# EAGLE design clock (EAGLE 9.6.2)
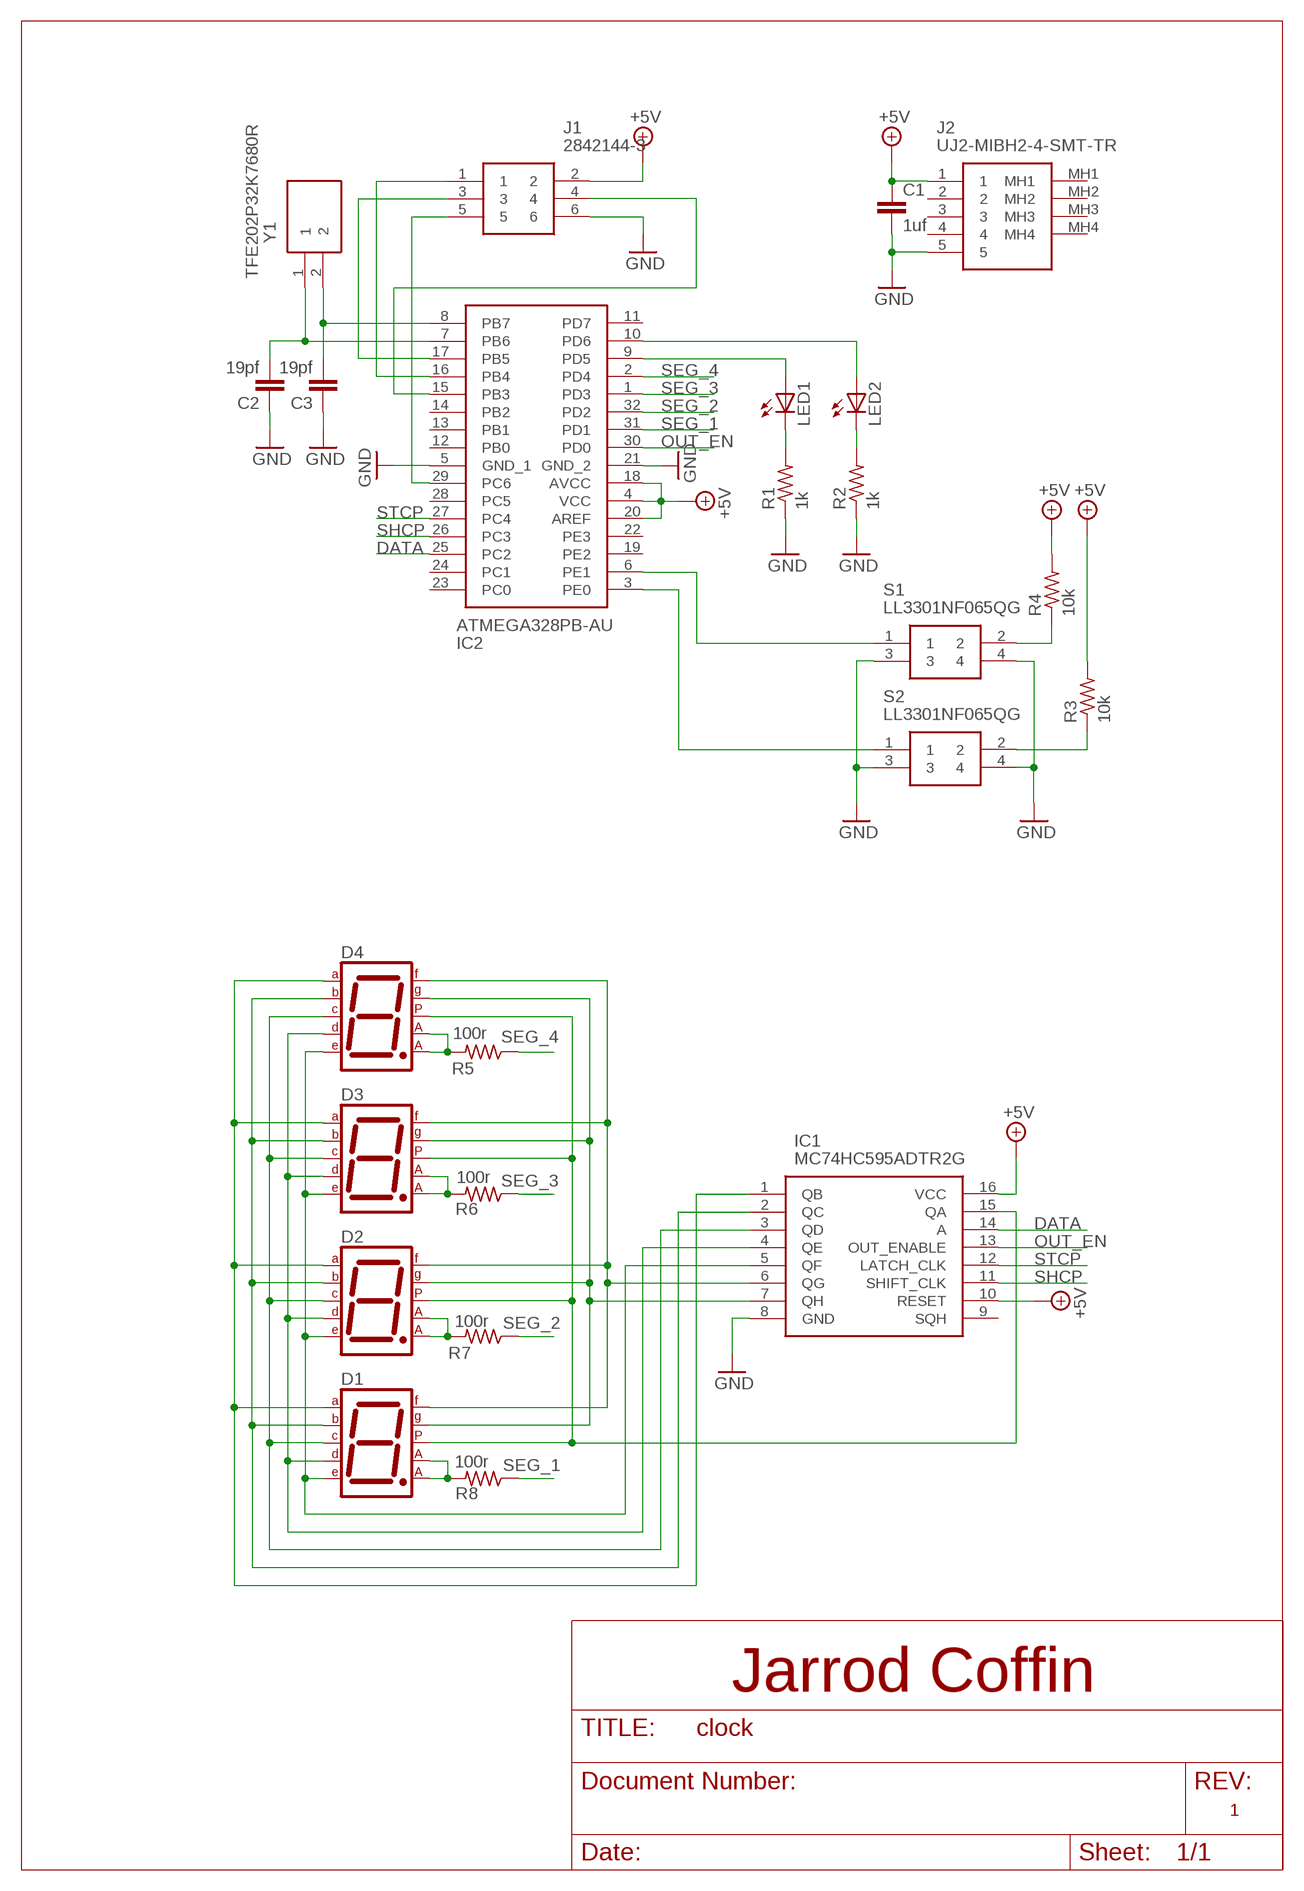
[diagram p0: schematic, sheet 1]

## Parts
C1  1uf  C-EUC0805  [C0805]
C2  19pf  C-EUC0603  [C0603]
C3  19pf  C-EUC0603  [C0603]
D1  7SEG-CA  [7SEG-13]
D2  7SEG-CA  [7SEG-13]
D3  7SEG-CA  [7SEG-13]
D4  7SEG-CA  [7SEG-13]
IC1  MC74HC595ADTR2G  [SOP65P640X120-16N]
IC2  ATMEGA328PB-AU  [QFP80P900X900X120-32N]
J1  2842144-3  [HUSSP6W50P200_2X3_600X400X590P]
J2  UJ2-MIBH2-4-SMT-TR  [UJ2MIBH24SMTTR]
LED1  LED3MM  [LED3MM]
LED2  LED3MM  [LED3MM]
R1  1k  R-US_R0805  [R0805]
R2  1k  R-US_R0805  [R0805]
R3  10k  R-US_R0805  [R0805]
R4  10k  R-US_R0805  [R0805]
R5  100r  R-US_R0805  [R0805]
R6  100r  R-US_R0805  [R0805]
R7  100r  R-US_R0805  [R0805]
R8  100r  R-US_R0805  [R0805]
S1  LL3301NF065QG  [LL3301NF065QG]
S2  LL3301NF065QG  [LL3301NF065QG]
Y1  TFE202P32K7680R  [TFE202P32K7680R]

## Nets
+5V: C1.1 IC1.10(RESET) IC1.16(VCC) IC2.4(VCC) IC2.18(AVCC) IC2.20(AREF) J1.2 J2.1 R3.2 R4.2
DATA: IC1.14(A) IC2.25(PC2)
GND: C1.2 C2.1 C3.1 IC1.8(GND) IC2.5(GND_1) IC2.21(GND_2) J1.6 J2.5 R1.1 R2.1 S1.3 S1.4 S2.3 S2.4
N$1: D1.10(G) D2.10(G) D3.10(G) D4.10(G) IC1.7(QH)
N$2: D1.9(F) D2.9(F) D3.9(F) D4.9(F) IC1.6(QG)
N$3: LED1.K(C) R1.2
N$4: LED2.K(C) R2.2
N$5: IC2.9(PD5) LED1.A
N$6: IC2.10(PD6) LED2.A
N$7: D1.5(DP) D2.5(DP) D3.5(DP) D4.5(DP) IC1.15(QA)
N$8: D1.1(E) D2.1(E) D3.1(E) D4.1(E) IC1.5(QF)
N$9: D1.2(D) D2.2(D) D3.2(D) D4.2(D) IC1.4(QE)
N$10: D1.4(C) D2.4(C) D3.4(C) D4.4(C) IC1.3(QD)
N$11: D1.6(B) D2.6(B) D3.6(B) D4.6(B) IC1.2(QC)
N$12: D1.7(A) D2.7(A) D3.7(A) D4.7(A) IC1.1(QB)
N$13: IC2.29(PC6) J1.5
N$14: IC2.15(PB3) J1.4
N$15: IC2.16(PB4) J1.1
N$16: IC2.17(PB5) J1.3
N$17: R4.1 S1.2
N$18: R3.1 S2.2
N$19: C2.2 IC2.7(PB6) Y1.1
N$20: IC2.3(PE0) S2.1
N$21: IC2.6(PE1) S1.1
N$23: D1.3(CA1) D1.8(CA2) R8.2
N$24: C3.2 IC2.8(PB7) Y1.2
N$26: D2.3(CA1) D2.8(CA2) R7.2
N$27: D3.3(CA1) D3.8(CA2) R6.2
N$29: D4.3(CA1) D4.8(CA2) R5.2
OUT_EN: IC1.13(OUT_ENABLE) IC2.30(PD0)
SEG_1: IC2.31(PD1) R8.1
SEG_2: IC2.32(PD2) R7.1
SEG_3: IC2.1(PD3) R6.1
SEG_4: IC2.2(PD4) R5.1
SHCP: IC1.11(SHIFT_CLK) IC2.26(PC3)
STCP: IC1.12(LATCH_CLK) IC2.27(PC4)
Unconnected: IC1.9(SQH) IC2.11(PD7) IC2.12(PB0) IC2.13(PB1) IC2.14(PB2) IC2.19(PE2) IC2.22(PE3) IC2.23(PC0) IC2.24(PC1) IC2.28(PC5) J2.2 J2.3 J2.4 J2.MH1 J2.MH2 J2.MH3 J2.MH4

## Notes on the sheet
- Jarrod Coffin
- 1

## Library data of the parts
C1-C3 = rcl:C-EU: CAPACITOR, European symbol; SPICEPREFIX: C
D1-D4 = special:7SEG-CA: 7-segment DISPLAY single anode, 13 mm
IC1 = SamacSys_Parts:MC74HC595ADTR2G: 8-Bit Shift Register SER-SER/PAR TSSOP16 MC74HC595ADTR2G, 8-stage Shift Register, Serial to Serial/Parallel, 2 6 V, 16-Pin TSSOP-16 Source: Datasheet <https://componentsearchengine.com/Datasheets/1/MC74HC595ADTR2G.pdf>; DESCRIPTION: 8-Bit Shift Register SER-SER/PAR TSSOP16 MC74HC595ADTR2G, 8-stage Shift Register, Serial to Serial/Parallel, 2 6 V, 16-Pin TSSOP-16; HEIGHT: 1.2mm; MANUFACTURER_NAME: ON Semiconductor; MANUFACTURER_PART_NUMBER: MC74HC595ADTR2G; MOUSER_PART_NUMBER: 863-MC74HC595ADTR2G; MOUSER_PRICE-STOCK: https://www.mouser.com/Search/Refine.aspx?Keyword=863-MC74HC595ADTR2G
IC2 = SamacSys_Parts:ATMEGA328PB-AU: ATMEL - ATMEGA328PB-AU - MCU, 8BIT, ATMEGA, 20MHZ, TQFP-32 Source: Datasheet <http://www.farnell.com/datasheets/2014286.pdf>; ARROW_PART_NUMBER: ATMEGA328PB-AU; ARROW_PRICE-STOCK: https://www.arrow.com/en/products/atmega328pb-au/microchip-technology; DESCRIPTION: ATMEL - ATMEGA328PB-AU - MCU, 8BIT, ATMEGA, 20MHZ, TQFP-32; HEIGHT: 1.2mm; MANUFACTURER_NAME: Microchip; MANUFACTURER_PART_NUMBER: ATMEGA328PB-AU; MOUSER_PART_NUMBER: 556-ATMEGA328PB-AU; MOUSER_PRICE-STOCK: https://www.mouser.co.uk/ProductDetail/Microchip-Technology-Atmel/ATMEGA328PB-AU?qs=jy4bLUHv09hbFONgGrqPbw%3D%3D
J1 = SamacSys_Parts:2842144-3: Board to Board & Mezzanine Connectors 6P,2MM,BRK HDR,DRVT, SMD,0.76AU,TR W/CAP Source: Datasheet <https://componentsearchengine.com/Datasheets/2/2842144-3.pdf>; ARROW_PART_NUMBER: 2842144-3; DESCRIPTION: Board to Board & Mezzanine Connectors 6P,2MM,BRK HDR,DRVT, SMD,0.76AU,TR W/CAP; HEIGHT: mm; MANUFACTURER_NAME: TE Connectivity; MANUFACTURER_PART_NUMBER: 2842144-3; MOUSER_PART_NUMBER: 571-2842144-3; MOUSER_PRICE-STOCK: https://www.mouser.co.uk/ProductDetail/TE-Connectivity/2842144-3?qs=Cb2nCFKsA8oUVnOWAoq9Vg%3D%3D
J2 = SamacSys_Parts:UJ2-MIBH2-4-SMT-TR: CONN RCPT USB2.0 MICRO B SMD R/A Source: Datasheet <https://www.cui.com/product/resource/digikeypdf/uj2-mibh2-4-smt.pdf>; ARROW_PART_NUMBER: UJ2-MIBH2-4-SMT-TR; ARROW_PRICE-STOCK: https://www.arrow.com/en/products/uj2-mibh2-4-smt-tr/cui-devices; DESCRIPTION: CONN RCPT USB2.0 MICRO B SMD R/A; HEIGHT: 2.5mm; MANUFACTURER_NAME: CUI Devices; MANUFACTURER_PART_NUMBER: UJ2-MIBH2-4-SMT-TR; MOUSER_PART_NUMBER: 490-UJ2-MIBH2-4-SMT; MOUSER_PRICE-STOCK: https://www.mouser.co.uk/ProductDetail/CUI-Devices/UJ2-MIBH2-4-SMT-TR?qs=5mqXD9RfOg1yxHIpPvPxvQ%3D%3D
LED1 LED2 = adafruit:LED: LED OSRAM: - CHIPLED LG R971, LG N971, LY N971, LG Q971, LY Q971, LO R971, LY R971 LH N974, LH R974 LS Q976, LO Q976, LY Q976 LO Q996 - Hyper CHIPLED LW Q18S LB Q993, LB Q99A, LB R99A - SideLED LS A670, LO A670, LY A670, LG A670, LP A670 LB A673, LV A673, LT A673, LW A673 LH A674 LY A675 LS A676, LA A676, LO A676, LY A676, LW A676 LS A679, LY A679, LG A679 - Hyper Micro SIDELED® LS Y876, LA Y876, LO Y876, LY Y876 LT Y87S - SmartLED LW L88C, LW L88S LB L89C, LB L89S, LG L890 LS L89K, LO L89K, LY L89K LS L896, LA L896, LO L896, LY L896 - TOPLED LS T670, LO T670, LY T670, LG T670, LP T670 LSG T670, LSP T670, LSY T670, LOP T670, LYG T670 LG T671, LOG T671, LSG T671 LB T673, LV T673, LT T673, LW T673 LH T674 LS T676, LA T676, LO T676, LY T676, LB T676, LH T676, LSB T676, LW T676 LB T67C, LV T67C, LT T67C, LS T67K, LO T67K, LY T67K, LW E67C LS E67B, LA E67B, LO E67B, LY E67B, LB E67C, LV E67C, LT E67C LW T67C LS T679, LY T679, LG T679 LS T770, LO T770, LY T770, LG T770, LP T770 LB T773, LV T773, LT T773, LW T773 LH T774 LS E675, LA E675, LY E675, LS T675 LS T776, LA T776, LO T776, LY T776, LB T776 LHGB T686 LT T68C, LB T68C - Hyper Mini TOPLED® LB M676 - Mini TOPLED Santana® LG M470 LS M47K, LO M47K, LY M47K Source: http://www.osram.convergy.de/
R1-R8 = adafruit:R-US_: RESISTOR, American symbol
S1 S2 = SamacSys_Parts:LL3301NF065QG: E-SWITCH - LL3301NF065QG - TACTILE SW, SPST, 0.05A, 12VDC, SOLDER Source: Datasheet <http://spec_sheets.e-switch.com/specs/P090002.pdf>; ARROW_PART_NUMBER: LL3301NF065QG; DESCRIPTION: E-SWITCH - LL3301NF065QG - TACTILE SW, SPST, 0.05A, 12VDC, SOLDER; HEIGHT: 4mm; MANUFACTURER_NAME: E-Switch; MANUFACTURER_PART_NUMBER: LL3301NF065QG; MOUSER_PART_NUMBER: 612-LL3301NF065QG; MOUSER_PRICE-STOCK: https://www.mouser.co.uk/ProductDetail/E-Switch/LL3301NF065QG?qs=QtyuwXswaQiWhwgY68YTTw%3D%3D
Y1 = SamacSys_Parts:TFE202P32K7680R: Crystals 32.768kHz 12.5pF 20ppm -40C +85C Source: Datasheet <https://www.mouser.cn/datasheet/2/96/TFE20-1115691.pdf>; ARROW_PART_NUMBER: TFE202P32K7680R; ARROW_PRICE-STOCK: https://www.arrow.com/en/products/tfe202p32k7680r/cts; DESCRIPTION: Crystals 32.768kHz 12.5pF 20ppm -40C +85C; HEIGHT: 0.6mm; MANUFACTURER_NAME: CTS; MANUFACTURER_PART_NUMBER: TFE202P32K7680R; MOUSER_PART_NUMBER: 774-TFE202P32K7680R; MOUSER_PRICE-STOCK: https://www.mouser.co.uk/ProductDetail/CTS-Electronic-Components/TFE202P32K7680R?qs=gt1LBUVyoHn5CYVn8A35IQ%3D%3D

## Board
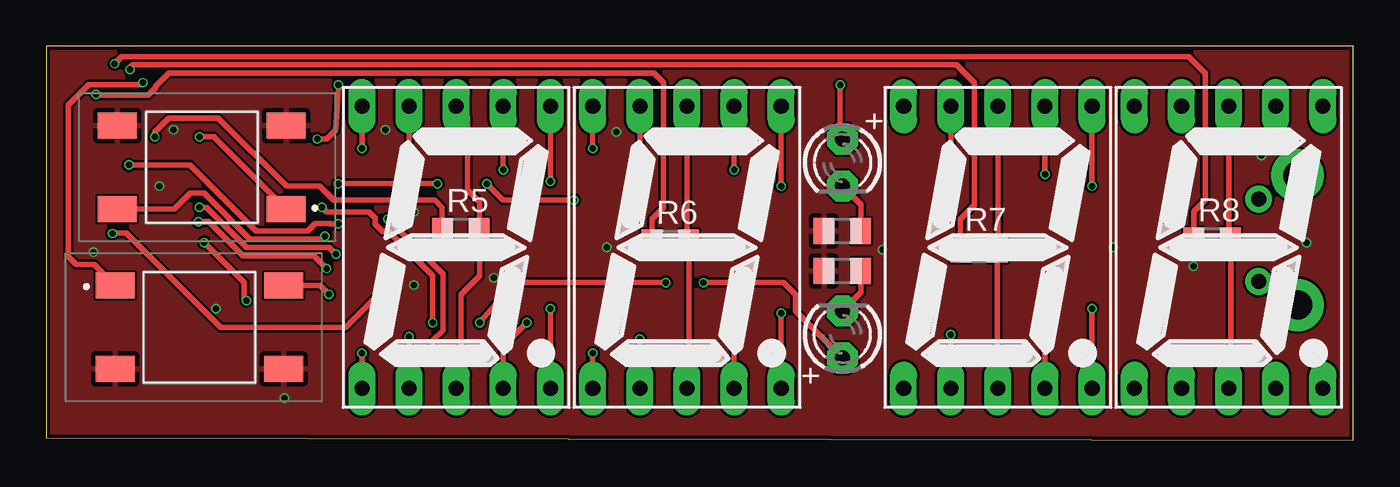
[diagram p1: board, top side]
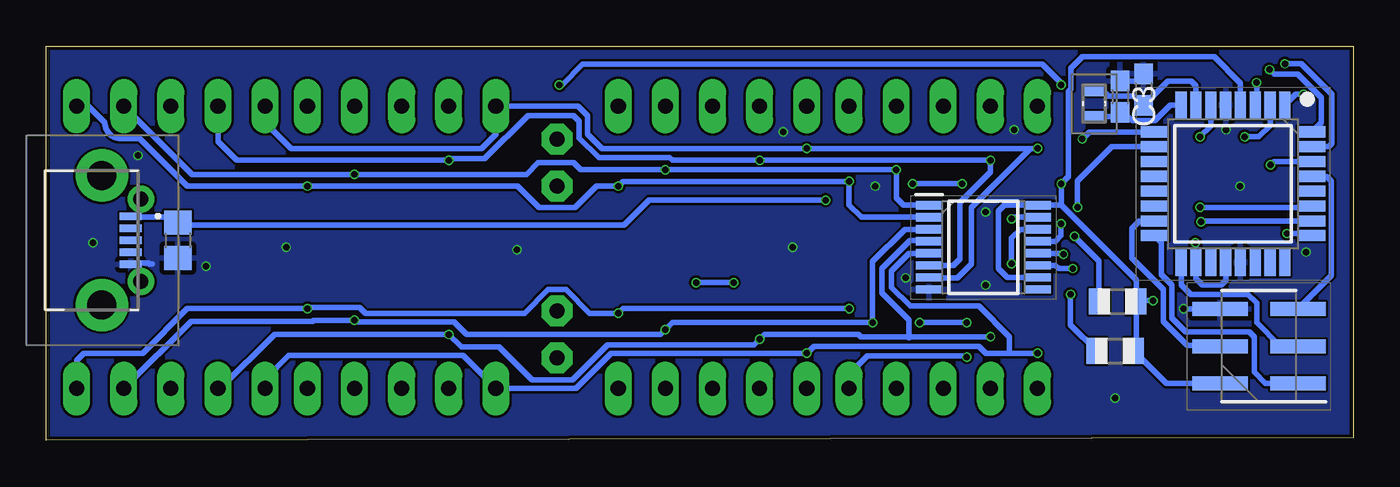
[diagram p2: board, bottom side, seen from below]

Size 70.47 x 21.26 mm. Coordinates in mm from the lower left corner, seen from the top.
Outline: 0,0.13 70.47,0 70.47,21.26 0,21.26 0,0.13
Copper layers (1*16): Top 0.035mm / dielectric 1.6mm / Bottom 0.035mm
Design rules "jlcpcb-2layers": minimum track width 5mil, minimum drill 0.3mm, track to track 5mil, track to pad 5mil, pad to pad 5mil, via to via 5mil, smd to smd 5mil, copper to edge 0.2mm, drill to drill 6mil, minimum pad ring 10mil, minimum via ring 3mil, stop-mask expansion 4mil, vias tented up to drill 0mil, thermal gap 10mil

### Footprints (pad centres in the part's own frame; a part is rotated, then mirrored left to right if it is on the bottom)
C0805 = smd 1.3 x 1.5: 1 -0.95,0; 2 0.95,0
C0603 = smd 1.1 x 1: 1 -0.85,0; 2 0.85,0
7SEG-13 = drill 0.813 long: 1 -5.08,-7.62; 2 -2.54,-7.62; 3 0,-7.62; 4 2.54,-7.62; 5 5.08,-7.62; 6 5.08,7.62; 7 2.54,7.62; 8 0,7.62; 9 -2.54,7.62; 10 -5.08,7.62
SOP65P640X120-16N = smd 1.45 x 0.45: 1 -2.925,2.275; 2 -2.925,1.625; 3 -2.925,0.975; 4 -2.925,0.325; 5 -2.925,-0.325; 6 -2.925,-0.975; 7 -2.925,-1.625; 8 -2.925,-2.275; 9 2.925,-2.275; 10 2.925,-1.625; 11 2.925,-0.975; 12 2.925,-0.325; 13 2.925,0.325; 14 2.925,0.975; 15 2.925,1.625; 16 2.925,2.275
QFP80P900X900X120-32N = smd 1.475 x 0.6: 1 -4.238,2.8; 2 -4.238,2; 3 -4.238,1.2; 4 -4.238,0.4; 5 -4.238,-0.4; 6 -4.238,-1.2; 7 -4.238,-2; 8 -4.238,-2.8; 17 4.238,-2.8; 18 4.238,-2; 19 4.238,-1.2; 20 4.238,-0.4; 21 4.238,0.4; 22 4.238,1.2; 23 4.238,2; 24 4.238,2.8 | smd 0.6 x 1.475: 9 -2.8,-4.238; 10 -2,-4.238; 11 -1.2,-4.238; 12 -0.4,-4.238; 13 0.4,-4.238; 14 1.2,-4.238; 15 2,-4.238; 16 2.8,-4.238; 25 2.8,4.238; 26 2,4.238; 27 1.2,4.238; 28 0.4,4.238; 29 -0.4,4.238; 30 -1.2,4.238; 31 -2,4.238; 32 -2.8,4.238
HUSSP6W50P200_2X3_600X400X590P = smd 0.75 x 3: 1 -2,-2.1; 2 -2,2.1; 3 0,-2.1; 4 0,2.1; 5 2,-2.1; 6 2,2.1
UJ2MIBH24SMTTR = smd 1.2 x 0.4: 1 2.025,1.3; 2 2.025,0.65; 3 2.025,0; 4 2.025,-0.65; 5 2.025,-1.3 | drill 0.8 pad 1.2: MH1 2.575,2.225; MH2 2.575,-2.225 | drill 1.565 pad 2.348: MH3 0.475,-3.5; MH4 0.475,3.5
LED3MM = drill 0.813 pad 1.676 octagon: A -1.27,0; K 1.27,0
R0805 = smd 1.1 x 1.4: 1 -1,0; 2 1,0
LL3301NF065QG = smd 2.1 x 1.4: 1 -4.55,2.25; 2 4.55,2.25; 3 -4.55,-2.25; 4 4.55,-2.25
TFE202P32K7680R = smd 0.6 x 1.1: 1 -0.7,0; 2 0.7,0

### Placement (x,y rotation side)
C1  63.37,10.8 270 bottom
C2  11.3,18.92 270 bottom
C3  12.57,18.54 270 bottom
D1  63.75,10.41 0 top
D2  51.31,10.41 0 top
D3  34.54,10.41 0 top
D4  22.1,10.41 0 top
IC1  19.94,10.41 0 bottom
IC2  6.48,13.84 270 bottom
J1  5.08,5.08 90 bottom
J2  67.94,10.8 0 bottom
LED1  42.93,14.99 270 top
LED2  42.93,5.72 90 top
R1  42.93,11.3 0 top
R2  42.93,9.14 0 top
R3  12.83,4.83 0 bottom
R4  12.7,7.49 0 bottom
R5  22.35,11.3 0 top
R6  33.65,10.67 0 top
R7  50.29,10.29 0 top
R8  62.87,10.8 0 top
S1  8.38,14.73 180 top
S2  8.26,6.1 0 top
Y1  13.97,18.16 270 bottom

### Tracks (layer width: path | path; a pad name or v marks a point on that pad's centre or on a via)
+5V  (via drill 0.35)
  Top 0.305: v8.51,10.67 10.67,8.51 10.67,7.66 v10.79,7.54 | v28.45,12.95 24.64,12.95 v23.75,13.84 | v21.08,13.84 v15.74,13.84
  Bottom 0.305: J1.2 10.08,3.08 R3.2 11.7,4.95 R4.2 | v8.51,10.67 8.48,10.64 IC2.18 8.48,8.73 8.13,8.38 7.11,8.38 6.88,8.62 IC2.20 | v10.79,7.54 11.65,7.54 R4.2 | R4.2 11.7,8.65 15.74,12.69 | 15.74,12.69 IC1.16 18.81,12.69 19.13,12.37 19.13,9.27 18.65,8.79 IC1.10 | 15.74,12.69 v15.74,13.84 15.36,14.22 15.36,18.82 15.22,18.96 15.22,20.09 14.6,20.7 7.49,20.7 6.08,19.29 IC2.4 | J2.1 65.8,12.09 65.77,12.06 63.69,12.06 C1.1 63.25,11.62 39.31,11.62 37.97,12.95 v28.45,12.95 | v23.75,13.84 v21.08,13.84
DATA  (via drill 0.35)
  Top 0.305: v18.41,9.52 18.41,8.38 16.13,6.1 9.4,6.1 4.32,11.18 3.57,11.18 v3.56,11.16
  Bottom 0.305: IC1.14 17.95,11.39 18.41,10.92 v18.41,9.52 | v3.56,11.16 2.36,11.16 IC2.25
GND  (via drill 0.35)
  Bottom 0.305: v9.14,7.11 9.11,7.08 J1.6 | J2.5 65.86,9.49 65.78,9.57 64.96,9.57 64.91,9.52 64.77,9.52 | C3.1 11.68,19.39 C2.1
  other vias: 30.23,10.41 45.09,10.29 57.53,10.41 67.94,10.67 2.54,10.16 6.86,16.76 12.83,2.29 19.81,8.38 61.85,9.4 24.13,8.76 18.29,16.76 30.73,16.64 65.53,15.37 19.81,12.32 6.1,13.72 25.78,13.72
  pour Bottom: -0.13,21.34 70.61,21.34 70.61,0 -0.13,0
  pour Top: -0.13,21.34 70.61,21.34 70.61,0 -0.13,0
N$1  (via drill 0.35)
  Top 0.305: D4.10 v17.02,15.75 | v29.46,15.75 D3.10
  Bottom 0.305: IC1.7 22.84,8.76 21.34,8.76 20.57,9.52 20.57,12.57 17.4,15.75 v17.02,15.75 v29.46,15.75 40.51,15.75 41.27,16.51 41.27,17.53 41.78,18.03 D2.10 46.23,16.51 46.99,15.75 57.28,15.75 58.67,17.15 D1.10
N$2  (via drill 0.35)
  Top 0.305: D4.9 v19.56,15.11 | v32,15.11 D3.9 | v48.77,15.11 D2.9
  Bottom 0.305: IC1.6 21.55,9.44 21.21,9.78 21.21,12.83 19.56,14.48 v19.56,15.11 v32,15.11 36.71,15.11 36.86,15.26 40.67,15.26 41.73,16.32 41.73,17.22 42.04,17.53 44.5,17.53 46.83,15.19 48.72,15.19 v48.77,15.11 60.2,15.11 61.21,16.13 D1.9
N$3
  Top 0.305: LED1.K 43.93,12.72 R1.2
N$4
  Top 0.305: LED2.K 43.93,7.98 R2.2
N$5  (via drill 0.35)
  Top 0.305: LED1.A 42.8,16.38 v42.8,19.18 | v15.75,19.18 15.75,19.05 15.6,16.75 15.11,16.26 v14.6,16.26
  Bottom 0.305: v42.8,19.18 42.66,19.18 41.55,20.3 16.74,20.3 15.75,19.3 v15.75,19.18 | v14.6,16.26 14.22,16.64 IC2.9
N$6  (via drill 0.35)
  Top 0.305: LED2.A 40.39,6.98 40.39,7.87 39.75,8.51 v35.43,8.51 | v33.4,8.51 25.27,8.51 v23.37,6.35 | v20.83,6.35 20.83,8.88 18.45,11.26 18.13,11.26 17.73,11.66 17.73,11.99 17.4,12.32 15.11,12.32 v14.86,12.57
  Bottom 0.305: v35.43,8.51 v33.4,8.51 | v23.37,6.35 v20.83,6.35 | IC2.10 13,15.84 14.86,13.98 v14.86,12.57
N$7  (via drill 0.35)
  Top 0.305: D3.5 v39.62,6.86 | v56.39,7.11 D2.5 | D4.5 v27.18,7.11 | v18.41,11.95 21.38,8.98 21.38,5.94 20.83,5.38 v20.83,4.49
  Bottom 0.305: D1.5 68.83,4.32 68.45,4.7 65.28,4.7 62.87,7.11 v56.39,7.11 56.34,7.16 53.57,7.16 53.26,6.86 44.67,6.86 43.4,8.13 42.45,8.13 41.18,6.86 v39.62,6.86 39.37,7.11 v27.18,7.11 | IC1.15 18.32,12.04 v18.41,11.95 | v20.83,4.49 20.88,4.49 20.94,4.55 26.19,4.55 27.18,3.56 D4.5
N$8  (via drill 0.35)
  Top 0.305: D4.1 v17.02,4.7 | v29.46,4.7 D3.1
  Bottom 0.305: D1.1 58.67,3.3 57.4,4.57 48.01,4.57 D2.1 41.91,2.79 40.01,4.7 v29.46,4.7 29.08,5.08 20.19,5.08 19.81,4.7 18.54,4.7 | IC1.5 23.95,10.09 24.89,9.14 24.89,8.26 23.88,7.24 20.19,7.24 18.54,5.59 18.54,4.7 | 18.54,4.7 v17.02,4.7
N$9  (via drill 0.35)
  Top 0.305: D4.2 v19.56,5.59 | v32,5.46 D3.2 | v48.77,5.72 D2.2
  Bottom 0.305: 23.95,5.59 26.54,5.59 26.67,5.72 31.75,5.72 v32,5.46 32.31,5.16 40.19,5.16 42.1,3.25 44.28,3.25 46.06,5.03 48.08,5.03 v48.77,5.72 58.17,5.72 61.09,2.79 D1.2 | IC1.4 22.92,10.8 23.89,10.8 25.4,9.28 25.4,7.95 23.95,6.51 23.95,5.59 | 23.95,5.59 23.95,5.54 23.91,5.59 v19.56,5.59
N$10  (via drill 0.35)
  Top 0.305: v37.08,5.97 D3.4 | v53.85,6.48 D2.4 | D4.4 24.64,5.08 v25.91,6.35
  Bottom 0.305: D1.4 62.66,6.43 56.1,6.43 56.06,6.48 v53.85,6.48 53.77,6.4 48.49,6.4 47.8,5.72 37.34,5.72 v37.08,5.97 36.7,6.35 v25.91,6.35 25.91,9.65 24.17,11.39 IC1.3
N$11  (via drill 0.35)
  Top 0.305: D4.6 v27.18,13.97 | v39.62,13.72 D3.6 | v56.39,13.72 D2.6
  Bottom 0.305: IC1.2 26.52,12.04 27.18,12.7 v27.18,13.97 39.37,13.97 v39.62,13.72 40.8,13.72 41.95,12.57 43.91,12.57 45.05,13.72 v56.39,13.72 62.87,13.72 65.43,16.28 66.45,16.28 arc90 67.31,17.15 68.2,18.03 D1.6
N$12  (via drill 0.35)
  Top 0.305: D4.7 v24.64,14.6 | v37.08,14.6 D3.7 | v53.85,14.35 D2.7
  Bottom 0.305: IC1.1 24.25,12.69 24.64,13.08 v24.64,14.6 v37.08,14.6 41.66,14.6 42.04,14.99 43.94,14.99 44.58,14.35 v53.85,14.35 62.61,14.35 D1.7
N$13
  Bottom 0.305: J1.5 1.17,8.89 1.17,13.99 1.42,14.24 IC2.29
N$14
  Bottom 0.305: J1.4 7.23,5.13 8.95,5.13 10.24,6.41 10.24,8.14 11.94,9.84 11.94,11.43 11.52,11.84 IC2.15
N$15
  Bottom 0.305: J1.1 4.73,3.08 5.33,3.68 5.33,5.59 5.59,5.84 9.02,5.84 9.78,6.6 9.78,8.38 10.33,8.94 10.33,10.66 IC2.16
N$16
  Bottom 0.305: J1.3 3.94,5.08 5.21,6.35 5.21,7.41 5.67,7.87 8.76,7.87 9.28,8.39 IC2.17
N$17  (via drill 0.35)
  Top 0.305: S1.2 6.89,12.48 7.75,13.34 8.51,13.34 10.97,10.87 14.88,10.87 v15.02,11.01
  Bottom 0.305: v15.02,11.01 13.7,9.69 R4.1
N$18  (via drill 0.35)
  Top 0.305: v15.24,7.87 14.77,8.35 S2.2
  Bottom 0.305: R3.1 15.24,6.24 v15.24,7.87
N$19
  Bottom 0.305: IC2.7 8.48,19.15 8.72,19.39 9.98,19.39 C2.2 | 11.53,17.84 C2.2 | Y1.1 13.49,18.86 13.19,18.56 11.79,18.56 C2.2
N$20  (via drill 0.35)
  Top 0.305: S2.1 2.57,9.48 1.62,9.48 1.17,9.93 1.17,18.09 2.29,19.2 5.21,19.2 v5.21,19.3
  Bottom 0.305: IC2.3 5.21,18.15 v5.21,19.3
N$21  (via drill 0.35)
  Top 0.305: S1.1 9.03,16.38 v8.26,16.38
  Bottom 0.305: v8.26,16.38 7.68,16.96 IC2.6
N$23
  Top 0.305: D1.8 63.75,10.91 R8.2 63.87,2.91 D1.3
N$24
  Bottom 0.305: 12.57,17.91 C3.2 | Y1.2 12.8,17.46 C3.2 | C3.2 12.37,17.69 11.92,17.24 10.69,17.24 10.52,17.41 10.52,17.42 9.86,18.08 IC2.8
N$26
  Top 0.305: D2.8 51.31,10.3 R7.2 51.29,2.81 D2.3
N$27
  Top 0.305: D3.8 34.54,10.78 R6.2 34.65,2.91 D3.3
N$29
  Top 0.305: D4.8 22.71,17.42 22.71,13.5 23.35,12.85 R5.2 23.35,8.87 22.35,7.87 22.35,3.05 D4.3
OUT_EN  (via drill 0.35)
  Top 0.305: v15.75,11.68 15.32,11.68 15.31,11.69 14.49,11.69 14.1,11.3 11.3,11.3 7.75,14.86 v4.45,14.86
  Bottom 0.305: IC1.13 16.06,10.74 15.75,11.05 v15.75,11.68 | v4.45,14.86 4.26,15.04 IC2.30
SEG_1  (via drill 0.35)
  Top 0.305: v3.68,20.32 4.06,20.7 61.6,20.7 62.48,19.81 62.48,12.95 62.23,12.7 61.98,12.45 61.87,12.34 R8.1
  Bottom 0.305: v3.68,20.32 3.67,20.33 2.8,20.33 1.14,18.68 1.14,16 1.3,15.84 IC2.31
SEG_2  (via drill 0.35)
  Top 0.305: v4.51,20 4.45,20.07 4.65,20.27 49.07,20.27 50.04,19.3 50.04,12.7 49.29,11.95 R7.1
  Bottom 0.305: v4.51,20 4.26,19.75 2.98,19.75 1.73,18.49 1.73,17.15 IC2.32
SEG_3  (via drill 0.35)
  Top 0.305: v2.67,18.67 2.72,18.62 5.49,18.62 5.89,19.02 5.89,19.1 6.6,19.81 32.77,19.81 33.27,19.3 33.27,12.57 32.65,11.95 R6.1
  Bottom 0.305: v2.67,18.67 3.09,18.67 IC2.1
SEG_4  (via drill 0.35)
  Top 0.305: v5.84,16.38 5.84,16.64 6.6,17.4 9.27,17.4 12.95,13.72 14.73,13.72 15.49,12.95 20.95,12.95 21.35,12.56 R5.1
  Bottom 0.305: v5.84,16.38 5.08,16.38 4.48,16.99 IC2.2
SHCP  (via drill 0.35)
  Top 0.305: v15.11,9.27 14.43,9.96 10.61,9.96 8.76,11.8 8.21,11.8 v8.2,11.79
  Bottom 0.305: IC1.11 16.04,9.44 15.88,9.27 v15.11,9.27 | v8.2,11.79 8.15,11.84 IC2.26
STCP  (via drill 0.35)
  Top 0.305: v15.62,10.03 15.24,10.41 10.8,10.41 8.64,12.57 v8.26,12.57
  Bottom 0.305: IC1.12 15.68,10.09 v15.62,10.03 | v8.26,12.57 2.31,12.57 IC2.27